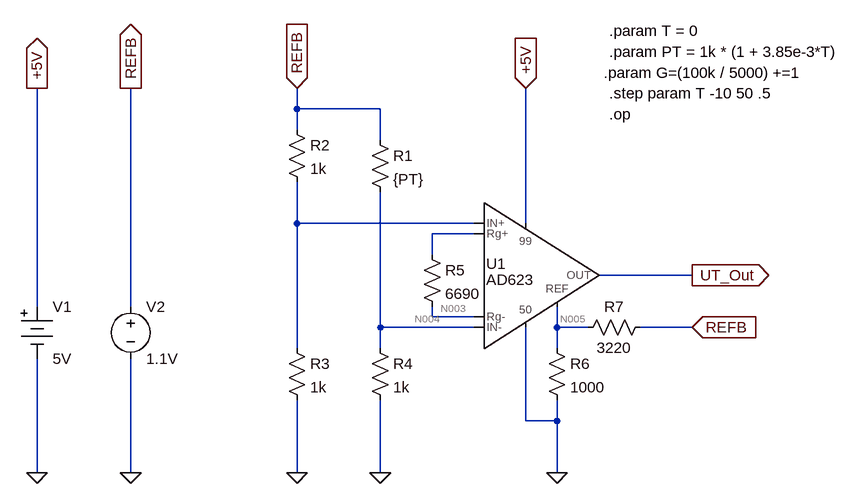
[diagram p0: schematic analog_amplifier_final_check.asc]
analog_amplifier_final_check.asc, the LTspice schematic file:
Version 4
SHEET 1 880 680
WIRE -96 -128 -96 -160
WIRE 32 -128 -96 -128
WIRE -96 -96 -96 -128
WIRE 32 -80 32 -128
WIRE -96 48 -96 -16
WIRE 176 48 -96 48
WIRE 256 48 256 -160
WIRE 176 64 112 64
WIRE 112 96 112 64
WIRE 512 128 368 128
WIRE -496 176 -496 -160
WIRE -352 176 -352 -160
WIRE 112 192 112 176
WIRE 176 192 112 192
WIRE 32 208 32 0
WIRE 176 208 32 208
WIRE 304 208 304 176
WIRE 352 208 304 208
WIRE 512 208 432 208
WIRE -96 240 -96 48
WIRE 32 240 32 208
WIRE 304 240 304 208
WIRE 256 352 256 208
WIRE 304 352 304 320
WIRE 304 352 256 352
WIRE -496 432 -496 256
WIRE -352 432 -352 256
WIRE -96 432 -96 320
WIRE 32 432 32 320
WIRE 304 432 304 352
FLAG -496 432 0
FLAG -496 -160 +5V
IOPIN -496 -160 Out
FLAG -352 432 0
FLAG -352 -160 REFB
IOPIN -352 -160 Out
FLAG -96 -160 REFB
IOPIN -96 -160 In
FLAG -96 432 0
FLAG 32 432 0
FLAG 304 432 0
FLAG 256 -160 +5V
IOPIN 256 -160 In
FLAG 512 128 UT_Out
IOPIN 512 128 Out
FLAG 512 208 REFB
IOPIN 512 208 In
SYMBOL ad623 192 128 R0
WINDOW 3 3 7 Left 2
WINDOW 0 3 -18 Left 2
SYMATTR InstName U1
SYMBOL Misc\\battery -496 160 R0
WINDOW 123 0 0 Left 0
WINDOW 39 0 0 Left 0
SYMATTR InstName V1
SYMATTR Value 5V
SYMBOL voltage -352 160 R0
WINDOW 123 0 0 Left 0
WINDOW 39 0 0 Left 0
SYMATTR InstName V2
SYMATTR Value 1.1V
SYMBOL res 16 -96 R0
SYMATTR InstName R1
SYMATTR Value {PT}
SYMBOL res -112 -112 R0
SYMATTR InstName R2
SYMATTR Value 1k
SYMBOL res -112 224 R0
SYMATTR InstName R3
SYMATTR Value 1k
SYMBOL res 16 224 R0
SYMATTR InstName R4
SYMATTR Value 1k
SYMBOL res 96 80 R0
SYMATTR InstName R5
SYMATTR Value 6690
SYMBOL res 288 224 R0
SYMATTR InstName R6
SYMATTR Value 1000
SYMBOL res 448 192 R90
WINDOW 0 0 56 VBottom 2
WINDOW 3 32 56 VTop 2
SYMATTR InstName R7
SYMATTR Value 3220
TEXT 384 -248 Left 2 !.param T = 0
TEXT 384 -216 Left 2 !.param PT = 1k * (1 + 3.85e-3*T)
TEXT 376 -184 Left 2 !.param G=(100k / 5000) +=1
TEXT 384 -152 Left 2 !.step param T -10 50 .5
TEXT 384 -120 Left 2 !.op

The netlist it stands for:
* analog_amplifier_final_check.asc
XU1 N001 N004 N002 N003 +5V 0 UT_Out N005 AD623  ; pins IN+ IN- Rg+ Rg- 99 50 OUT REF
V1 +5V 0 5V
V2 REFB 0 1.1V
R1 REFB N004 {PT}
R2 REFB N001 1k
R3 N001 0 1k
R4 N004 0 1k
R5 N002 N003 6690
R6 N005 0 1000
R7 REFB N005 3220
.param T = 0
.param PT = 1k * (1 + 3.85e-3*T)
.param G=(100k / 5000) +=1
.step param T -10 50 .5
.op
.lib ad623.cir
.backanno
.end

* Results of the author's LTspice run, read from the files saved beside the schematic
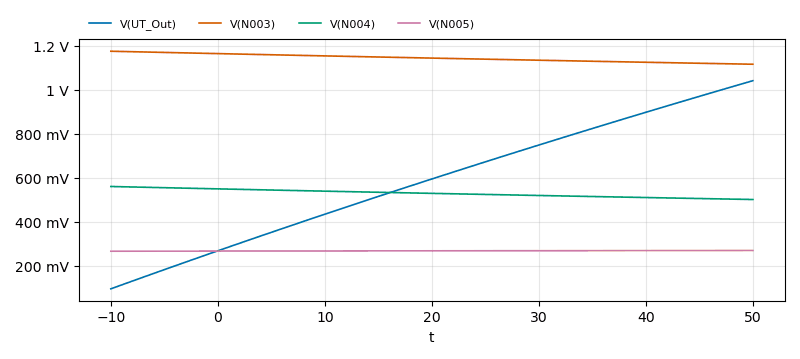
[diagram p1: Operating Point of analog_amplifier_final_check.asc, plotted from the saved traces]
* Operating Point, 1 run:
*   V(UT_Out): 96.01 mV at t=-10 , 1.041 V at t=50 , min 96.01 mV, max 1.041 V
*   V(N003): 1.175 V at t=-10 , 1.116 V at t=50 , min 1.116 V, max 1.175 V
*   V(N004): 560.8 mV at t=-10 , 501.7 mV at t=50 , min 501.7 mV, max 560.8 mV
*   V(N005): 266.9 mV at t=-10 , 270.2 mV at t=50 , min 266.9 mV, max 270.2 mV
* From the log:
*   Semiconductor Device Operating Points:
*                           --- Diodes ---
*   Name:   d:u1:n1d    d:u1:n1c    d:u1:n1b     d:u1:6d     d:u1:5d
*   Model:  u1:dnoi1    u1:dnoi1    u1:dnoi1      u1:dx       u1:dx
*   Id:      5.57e-04    5.57e-04    5.57e-04   -1.90e-12   -1.90e-12
*   Vd:      6.40e-01    6.40e-01    6.40e-01   -1.90e+00   -1.90e+00
*   Req:     4.64e+01    4.64e+01    4.64e+01    1.00e+12    1.00e+12
*   CAP:     0.00e+00    0.00e+00    0.00e+00    0.00e+00    0.00e+00
*   Name:    d:u1:2d     d:u1:1d     d:u1:6c     d:u1:5c     d:u1:2c
*   Model:    u1:dx       u1:dx       u1:dx       u1:dx       u1:dx
*   Id:     -2.50e-12   -2.50e-12   -1.90e-12   -1.90e-12   -2.50e-12
*   Vd:     -2.50e+00   -2.50e+00   -1.90e+00   -1.90e+00   -2.50e+00
*   Req:     1.00e+12    1.00e+12    1.00e+12    1.00e+12    1.00e+12
*   CAP:     0.00e+00    0.00e+00    0.00e+00    0.00e+00    0.00e+00
*   Name:    d:u1:1c     d:u1:6b     d:u1:5b     d:u1:2b     d:u1:1b
*   Model:    u1:dx       u1:dx       u1:dx       u1:dx       u1:dx
*   Id:     -2.50e-12   -1.90e-12   -1.90e-12   -6.76e-13   -4.32e-12
*   Vd:     -2.50e+00   -1.90e+00   -1.90e+00   -6.76e-01   -4.32e+00
*   Req:     1.00e+12    1.00e+12    1.00e+12    1.00e+12    1.00e+12
*   CAP:     0.00e+00    0.00e+00    0.00e+00    0.00e+00    0.00e+00
*                           --- Bipolar Transistors ---
*   Name:     q:u1:4d     q:u1:4c     q:u1:4b     q:u1:3d     q:u1:3c
*   Model:    u1:qnox     u1:qnox     u1:qnox     u1:qpox     u1:qpox
*   Ib:       5.25e-07    5.56e-07    2.69e-06   -5.73e-07   -5.41e-07
*   Ic:       5.28e-05    5.58e-05    6.33e-05   -6.59e-05   -6.23e-05
*   Vbe:      5.92e-01    5.94e-01    5.99e-01   -5.97e-01   -5.96e-01
*   Vbc:     -6.60e-01   -4.86e-01    5.05e-01    3.15e+00    3.32e+00
*   Vce:      1.25e+00    1.08e+00    9.40e-02   -3.74e+00   -3.92e+00
*   BetaDC:   1.01e+02    1.00e+02    2.35e+01    1.15e+02    1.15e+02
*   Gm:       2.04e-03    2.16e-03    2.52e-03    2.55e-03    2.41e-03
*   Rpi:      4.93e+04    4.65e+04    3.83e+04    4.51e+04    4.78e+04
*   Rx:       0.00e+00    0.00e+00    0.00e+00    0.00e+00    0.00e+00
*   Ro:       2.29e+06    2.16e+06    1.28e+04    1.87e+06    1.98e+06
*   Cbe:      0.00e+00    0.00e+00    0.00e+00    0.00e+00    0.00e+00
*   Cbc:      0.00e+00    0.00e+00    0.00e+00    0.00e+00    0.00e+00
*   Cjs:      0.00e+00    0.00e+00    0.00e+00    0.00e+00    0.00e+00
*   BetaAC:   1.01e+02    1.00e+02    9.66e+01    1.15e+02    1.15e+02
*   Cbx:      0.00e+00    0.00e+00    0.00e+00    0.00e+00    0.00e+00
*   Ft:       0.00e+00    0.00e+00    0.00e+00    0.00e+00    0.00e+00
*   Name:     q:u1:3b     q:u1:2d     q:u1:1d     q:u1:2c     q:u1:1c
*   Model:    u1:qpox     u1:qpi      u1:qpi      u1:qpi      u1:qpi
*   Ib:      -4.46e-07   -4.90e-08   -4.90e-08   -4.90e-08   -4.90e-08
*   Ic:      -5.17e-05   -4.95e-06   -4.95e-06   -4.95e-06   -4.95e-06
*   Vbe:     -5.91e-01   -6.37e-01   -6.37e-01   -6.37e-01   -6.37e-01
*   Vbc:      4.31e+00    1.13e+00    1.13e+00    1.12e+00    1.12e+00
*   Vce:     -4.90e+00   -1.77e+00   -1.77e+00   -1.76e+00   -1.76e+00
*   BetaDC:   1.16e+02    1.01e+02    1.01e+02    1.01e+02    1.01e+02
*   Gm:       2.00e-03    1.91e-04    1.91e-04    1.91e-04    1.91e-04
*   Rpi:      5.80e+04    5.28e+05    5.28e+05    5.28e+05    5.28e+05
*   Rx:       0.00e+00    0.00e+00    0.00e+00    0.00e+00    0.00e+00
*   Ro:       2.40e+06    2.04e+07    2.04e+07    2.04e+07    2.04e+07
*   Cbe:      0.00e+00    0.00e+00    0.00e+00    0.00e+00    0.00e+00
*   Cbc:      0.00e+00    0.00e+00    0.00e+00    0.00e+00    0.00e+00
*   Cjs:      0.00e+00    0.00e+00    0.00e+00    0.00e+00    0.00e+00
*   BetaAC:   1.16e+02    1.01e+02    1.01e+02    1.01e+02    1.01e+02
*   Cbx:      0.00e+00    0.00e+00    0.00e+00    0.00e+00    0.00e+00
*   Ft:       0.00e+00    0.00e+00    0.00e+00    0.00e+00    0.00e+00
*   Name:     q:u1:2b     q:u1:1b    q:u1:in2    q:u1:in1
*   Model:    u1:qpi      u1:qpi      u1:qpi2     u1:qpi1
*   Ib:      -4.92e-08   -4.92e-08   -2.02e-08   -2.02e-08
*   Ic:      -4.95e-06   -4.95e-06   -2.03e-06   -2.03e-06
*   Vbe:     -6.37e-01   -6.37e-01   -6.14e-01   -6.14e-01
*   Vbc:      6.34e-01    6.34e-01    5.61e-01    5.50e-01
*   Vce:     -1.27e+00   -1.27e+00   -1.17e+00   -1.16e+00
*   BetaDC:   1.01e+02    1.01e+02    1.01e+02    1.01e+02
*   Gm:       1.91e-04    1.91e-04    7.84e-05    7.84e-05
*   Rpi:      5.26e+05    5.26e+05    1.28e+06    1.28e+06
*   Rx:       0.00e+00    0.00e+00    0.00e+00    0.00e+00
*   Ro:       2.03e+07    2.03e+07    4.92e+07    4.96e+07
*   Cbe:      0.00e+00    0.00e+00    0.00e+00    0.00e+00
*   Cbc:      0.00e+00    0.00e+00    0.00e+00    0.00e+00
*   Cjs:      0.00e+00    0.00e+00    0.00e+00    0.00e+00
*   BetaAC:   1.01e+02    1.01e+02    1.01e+02    1.01e+02
*   Cbx:      0.00e+00    0.00e+00    0.00e+00    0.00e+00
*   Ft:       0.00e+00    0.00e+00    0.00e+00    0.00e+00